# Altium project W5500-io_V100.PrjPcb
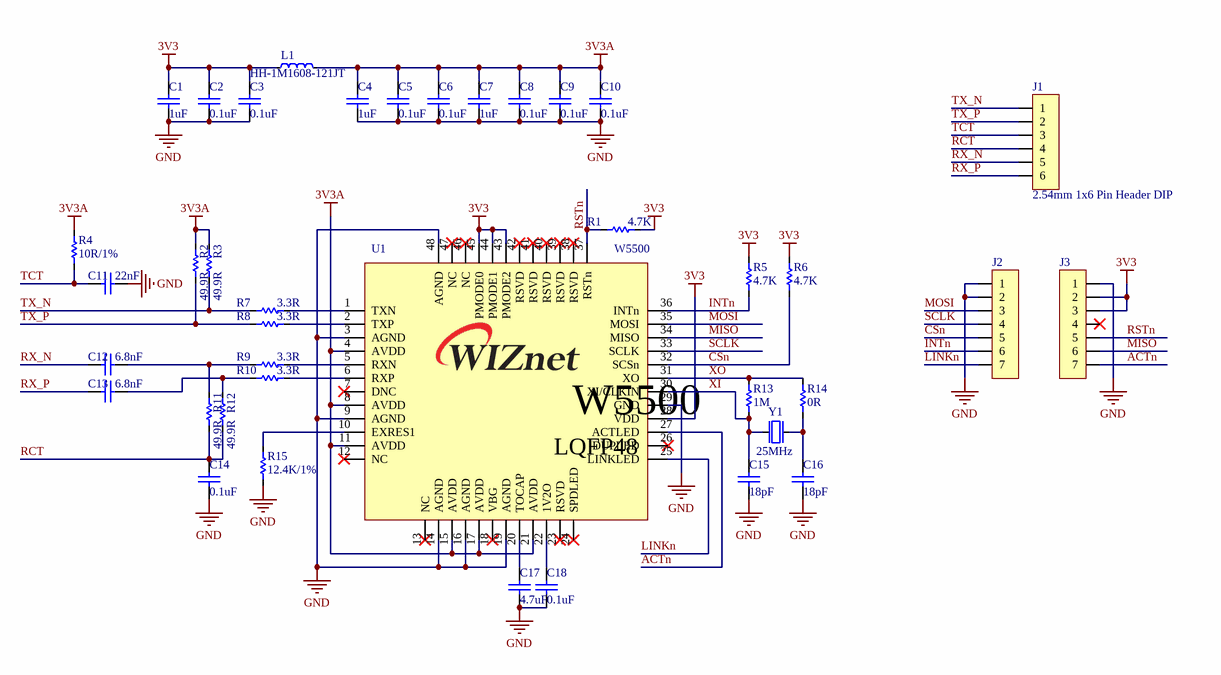
[diagram p0: W5500-io_V100.SchDoc]
1 sheet, 39 parts. Net scope: global (net labels, ports and power ports of the same name join across sheets).
Board file: W5500-io_V100.PcbDoc

## Sheet W5500-io_V100.SchDoc: W5500-io
size A4; DrawnBy: Scott; Revision: V100; SheetNumber: 1; SheetTotal: 1; Team: Edge

### Parts
C1  1uF  [CAP-0402]
C2  0.1uF  [CAP-0402]
C3  0.1uF  [CAP-0402]
C4  1uF  [CAP-0402]
C5  0.1uF  [CAP-0402]
C6  0.1uF  [CAP-0402]
C7  1uF  [CAP-0402]
C8  0.1uF  [CAP-0402]
C9  0.1uF  [CAP-0402]
C10  0.1uF  [CAP-0402]
C11  22nF  [CAP-0402]
C12  6.8nF  [CAP-0402]
C13  6.8nF  [CAP-0402]
C14  0.1uF  [CAP-0402]
C15  18pF  [CAP-0402]
C16  18pF  [CAP-0402]
C17  4.7uF  [CAP-0805]
C18  0.1uF  [CAP-0402]
J1  2.54mm 1x6 Pin Header DIP  [IDC-1X6(WI510IO)]
J2  2.54mm 1x7 Pin Header DIP  [IDC-1X7(WI510IO)]  (value not drawn)
J3  2.54mm 1x7 Pin Header DIP  [IDC-1X7(WI510IO)]  (value not drawn)
L1  HH-1M1608-121JT  [IND-0603]
R1  4.7K  [RES-0402]
R2  49.9R  [RES-0402]
R3  49.9R  [RES-0402]
R4  10R/1%  [RES-0402]
R5  4.7K  [RES-0402]
R6  4.7K  [RES-0402]
R7  3.3R  [RES-0402]
R8  3.3R  [RES-0402]
R9  3.3R  [RES-0402]
R10  3.3R  [RES-0402]
R11  49.9R  [RES-0402]
R12  49.9R  [RES-0402]
R13  1M  [RES-0402]
R14  0R  [RES-0402]
R15  12.4K/1%  [RES-0402]
U1  W5500  [W5500-LQFP48]
Y1  25MHz  [OSC-82J0626]

### Nets
3V3: C1.2 C2.2 C3.2 J3.2 J3.3 L1.1 R1.2 R5.1 R6.1 U1.28(VDD) U1.43(PMODE2) U1.44(PMODE1) U1.45(PMODE0)
3V3A: C4.2 C5.2 C6.2 C7.2 C8.2 C9.2 C10.2 L1.2 R2.2 R3.2 R4.1 U1.4(AVDD) U1.8(AVDD) U1.11(AVDD) U1.15(AVDD) U1.17(AVDD) U1.21(AVDD)
GND: C1.1 C2.1 C3.1 C4.1 C5.1 C6.1 C7.1 C8.1 C9.1 C10.1 C11.1 C14.1 C15.1 C16.1 C17.1 C18.1 J2.1 J2.2 J3.1 R15.2 U1.3(AGND) U1.9(AGND) U1.14(AGND) U1.16(AGND) U1.19(AGND) U1.29(GND) U1.48(AGND) Y1.2(GND) Y1.4(GND)
ACTn: J3.7 U1.27(ACTLED)
CSn: J2.5 R6.2 U1.32(SCSn)
INTn: J2.6 R5.2 U1.36(INTn)
LINKn: J2.7 U1.25(LINKLED)
MISO: J3.6 U1.34(MISO)
MOSI: J2.3 U1.35(MOSI)
RCT: C14.2 J1.4 R11.1 R12.1
RSTn: J3.5 R1.1 U1.37(RSTn)
RX_N: C12.2 J1.5
RX_P: C13.2 J1.6
SCLK: J2.4 U1.33(SCLK)
TCT: C11.2 J1.3 R4.2
TX_N: J1.1 R3.1 R7.1
TX_P: J1.2 R2.1 R8.1
XI: C15.2 R13.1 U1.30(XI/CLKIN) Y1.1(inp)
XO: R13.2 R14.2 U1.31(XO)
NetC12_1: C12.1 R9.1 R11.2
NetC13_1: C13.1 R10.1 R12.2
NetC16_2: C16.2 R14.1 Y1.3(out)
NetC17_2: C17.2 U1.20(TOCAP)
NetC18_2: C18.2 U1.22(1V2O)
NetR7_2: R7.2 U1.1(TXN)
NetR8_2: R8.2 U1.2(TXP)
NetR9_2: R9.2 U1.5(RXN)
NetR10_2: R10.2 U1.6(RXP)
NetR15_1: R15.1 U1.10(EXRES1)

Not connected (* = marked no-connect by the designer): J3 4*; U1 7(DNC)* 12(NC)* 13(NC)* 18(VBG)* 23(RSVD)* 24(SPDLED)* 26(DUPLED)* 38(RSVD)* 39(RSVD)* 40(RSVD)* 41(RSVD)* 42(RSVD)* 46(NC)* 47(NC)*

### Notes on the sheet
- Title
- Name :
- Date:
- Revision:
- Sheet
- of
- WIZnet Co., Ltd.
- 5F, Humax Village
- Hwangseaul-ro, Bundang-gu
- Seongnam-si, Gyeongi-do
- South Korea
- Team:
- Drawn By:
- (in symbol W5500) LQFP48

### Library data of the parts
C1-C16 C18 = CAP-0402: Ceramic CAP 0402(1005)
C17 = CAP-0805: Ceramic CAP 0805(2012)
L1 = IND-0603: Inductor 0603(1608)
R1-R15 = RES-0402
U1 = W5500: WIZnet Hardwired TCP/IP Chip
Y1 = OSC-82J0626-25MHz: X-tal 25MHz,3.2x2.5 SMD, CL=18pF